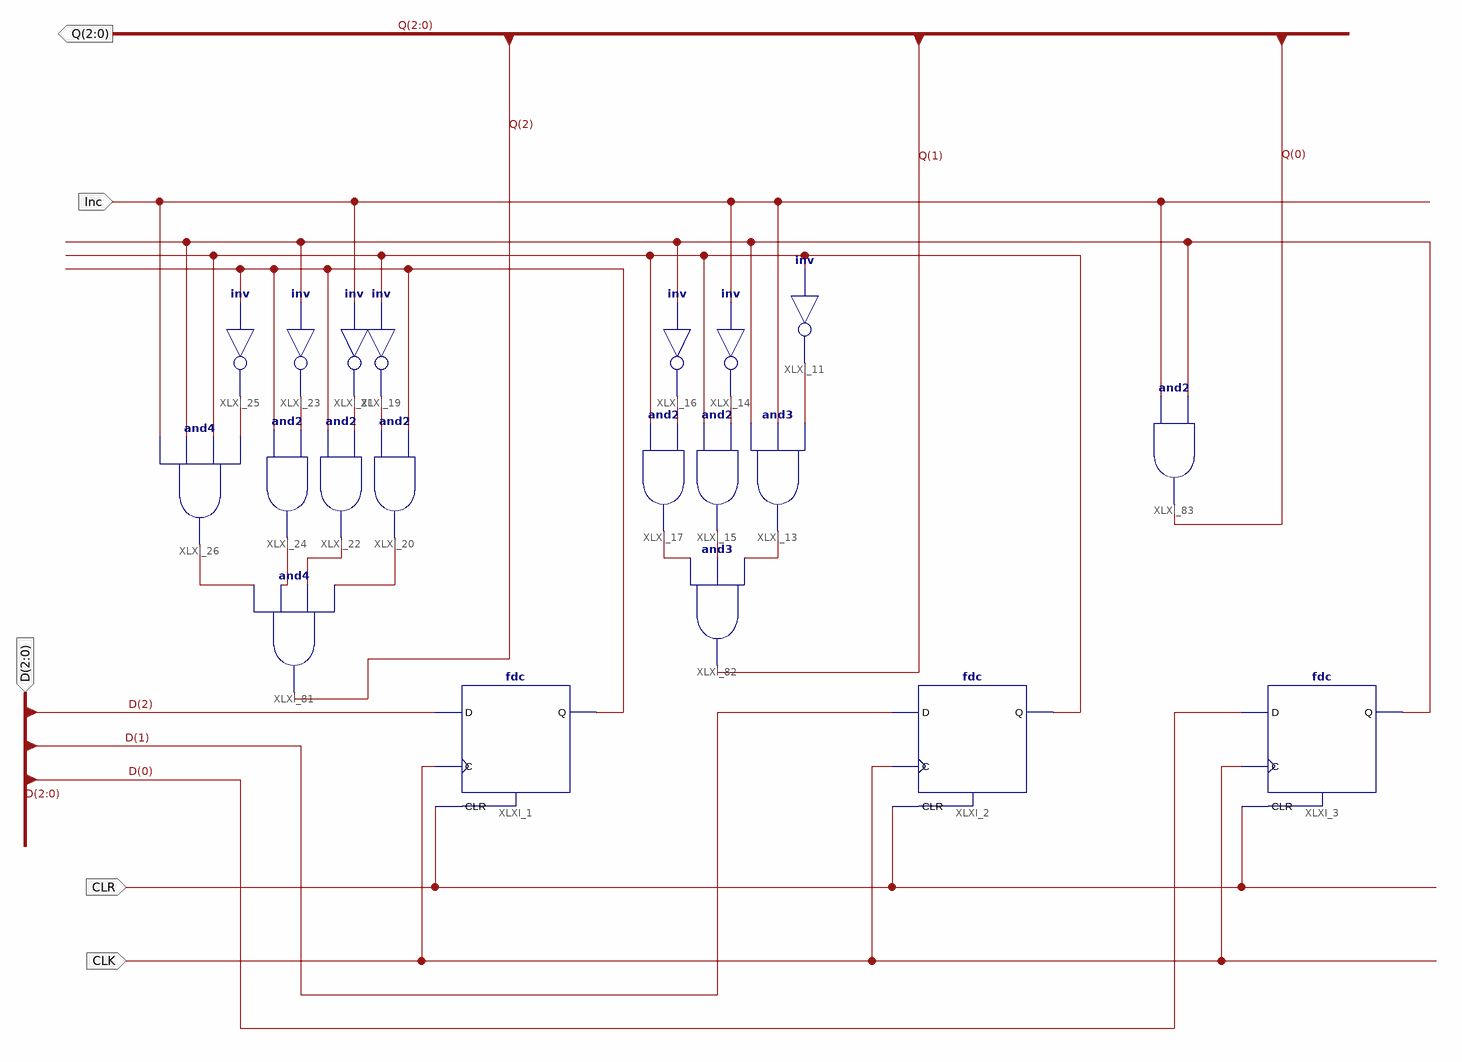
[diagram p0: schematic sheet 1]
// Xilinx ISE schematic PC.sch (spartan3e) as structural Verilog: 20 symbols, 5 ports
module PC (
  input  [2:0] D,
  input  CLK,
  input  CLR,
  input  Inc,
  output [2:0] Q
);

  wire Q0, Q1, Q2, XLXN_31, XLXN_33, XLXN_37, XLXN_38, XLXN_39, XLXN_40, XLXN_43, XLXN_46, XLXN_47, XLXN_48,
       XLXN_52, XLXN_53, XLXN_54, XLXN_55;

  and XLXI_15 (XLXN_39, Q1, XLXN_33);
  fdc XLXI_3 (.C(CLK), .CLR(CLR), .D(D[0]), .Q(Q0));
  fdc XLXI_2 (.C(CLK), .CLR(CLR), .D(D[1]), .Q(Q1));
  fdc XLXI_1 (.C(CLK), .CLR(CLR), .D(D[2]), .Q(Q2));
  not XLXI_19 (XLXN_43, Q1);
  and XLXI_17 (XLXN_40, Q1, XLXN_37);
  not XLXI_16 (XLXN_37, Q0);
  not XLXI_14 (XLXN_33, Inc);
  and XLXI_13 (XLXN_38, Q0, Inc, XLXN_31);
  not XLXI_11 (XLXN_31, Q1);
  not XLXI_25 (XLXN_48, Q2);
  not XLXI_23 (XLXN_47, Q0);
  not XLXI_21 (XLXN_46, Inc);
  and XLXI_26 (XLXN_55, Inc, Q0, Q1, XLXN_48);
  and XLXI_24 (XLXN_54, Q2, XLXN_47);
  and XLXI_22 (XLXN_53, Q2, XLXN_46);
  and XLXI_20 (XLXN_52, XLXN_43, Q2);
  and XLXI_81 (Q[2], XLXN_55, XLXN_54, XLXN_53, XLXN_52);
  and XLXI_82 (Q[1], XLXN_40, XLXN_39, XLXN_38);
  and XLXI_83 (Q[0], Inc, Q0);
endmodule
